# Altium schematic sheet AnalogSwitch.SchDoc
size A4
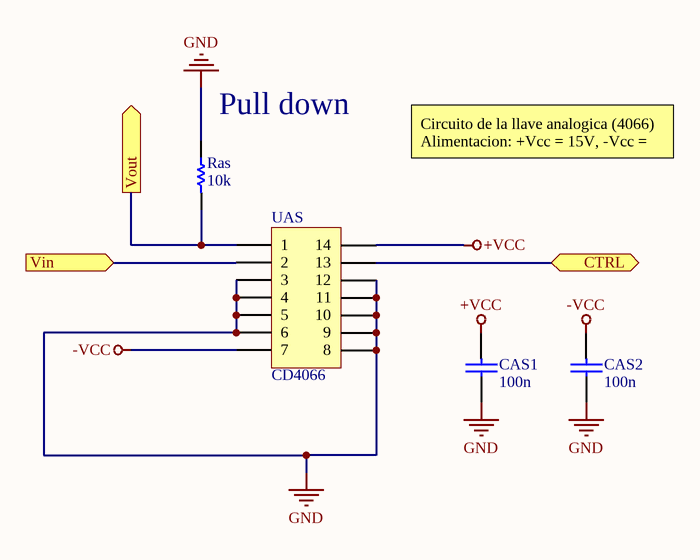
[diagram p0: AnalogSwitch.SchDoc]

## Parts
CAS1  100n  [CAP200]
CAS2  100n  [CAP200]
Ras  10k  [RES400]
UAS  CD4066  [DIP14]

## Ports
CTRL (bidir), Vin (in), Vout (out)

## Nets
+VCC: CAS1.1 UAS.14
-VCC: CAS2.1 UAS.7
GND: CAS1.2 CAS2.2 Ras.1 UAS.3 UAS.4 UAS.5 UAS.6 UAS.8 UAS.9 UAS.10 UAS.11 UAS.12
CTRL: UAS.13 ; port CTRL
Vin: UAS.2 ; port Vin
Vout: Ras.2 UAS.1 ; port Vout

## Notes on the sheet
- (near Ras) Pull down
- Circuito de la llave analogica (4066)
  Alimentacion: +Vcc = 15V, -Vcc = -15V

## Library data of the parts
CAS1 CAS2 = CAP
Ras = RES
UAS = IC_DIP14